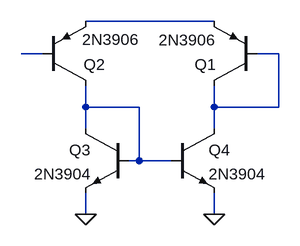
[diagram p0: schematic Draft1.asc]
Draft1.asc, the LTspice schematic file:
Version 4
SHEET 1 880 680
WIRE 480 112 288 112
WIRE 224 160 192 160
WIRE 576 160 544 160
WIRE 288 240 288 208
WIRE 368 240 288 240
WIRE 480 240 480 208
WIRE 576 240 576 160
WIRE 576 240 480 240
WIRE 288 272 288 240
WIRE 480 272 480 240
WIRE 368 320 368 240
WIRE 368 320 352 320
WIRE 416 320 368 320
WIRE 288 400 288 368
WIRE 480 400 480 368
FLAG 288 400 0
FLAG 480 400 0
SYMBOL pnp 544 208 R180
WINDOW 0 61 31 Left 2
WINDOW 3 62 68 Left 2
SYMATTR InstName Q1
SYMATTR Value 2N3906
SYMBOL pnp 224 208 M180
WINDOW 0 61 31 Left 2
WINDOW 3 59 69 Left 2
SYMATTR InstName Q2
SYMATTR Value 2N3906
SYMBOL npn 352 272 M0
SYMATTR InstName Q3
SYMATTR Value 2N3904
SYMBOL npn 416 272 R0
SYMATTR InstName Q4
SYMATTR Value 2N3904

The netlist it stands for:
* Draft1.asc
Q1 N003 N003 N001 0 2N3906
Q2 N004 N002 N001 0 2N3906
Q3 N004 N004 0 0 2N3904
Q4 N003 N004 0 0 2N3904
.model NPN NPN
.model PNP PNP
.lib standard.bjt
.backanno
.end